# Altium project BIO26_pishield.PrjPcb
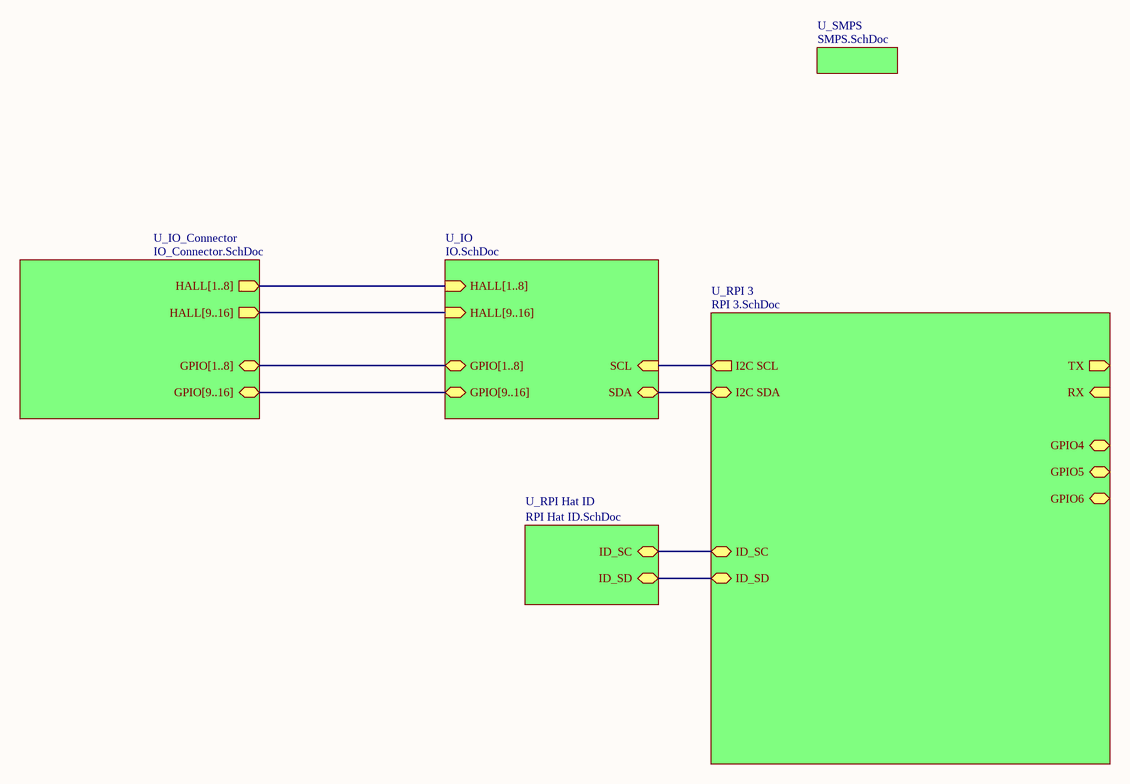
[diagram p0: BIO26_pishield.SchDoc]
6 sheets, 29 parts. Net scope: hierarchical (ports join the sheet entries above them; power ports are global).
Board file: BIO26_pishield.PcbDoc
Sheets:
  BIO26_pishield.SchDoc
    U_RPI 3 = RPI 3.SchDoc
    U_RPI Hat ID = RPI Hat ID.SchDoc
    U_SMPS = SMPS.SchDoc
    U_IO_Connector = IO_Connector.SchDoc
    U_IO = IO.SchDoc

## Sheet BIO26_pishield.SchDoc
size A4

### Sub-sheets
U_IO = IO.SchDoc: SCL (in), SDA (bidir), HALL[1..8] (in), HALL[9..16] (in), GPIO[1..8] (bidir), GPIO[9..16] (bidir)
U_IO_Connector = IO_Connector.SchDoc: HALL[1..8] (out), HALL[9..16] (out), GPIO[1..8] (bidir), GPIO[9..16] (bidir)
U_RPI 3 = RPI 3.SchDoc: GPIO4 (bidir), GPIO6 (bidir), GPIO5 (bidir), RX (in), TX (out), ID_SC (bidir), ID_SD (bidir), I2C SDA (bidir), I2C SCL (out)
U_RPI Hat ID = RPI Hat ID.SchDoc: ID_SC (bidir), ID_SD (bidir)
U_SMPS = SMPS.SchDoc: no entries

### Nets
I2C SCL: sheet U_RPI 3/I2C SCL, sheet U_IO/SCL
I2C SDA: sheet U_RPI 3/I2C SDA, sheet U_IO/SDA
NetR1_1: sheet U_RPI 3/ID_SD, sheet U_RPI Hat ID/ID_SD
NetR2_1: sheet U_RPI 3/ID_SC, sheet U_RPI Hat ID/ID_SC

### Buses and harness runs
bus sheet U_IO/GPIO[1..8] = sheet U_IO_Connector/GPIO[1..8]
bus sheet U_IO/GPIO[9..16] = sheet U_IO_Connector/GPIO[9..16]
bus sheet U_IO/HALL[1..8] = sheet U_IO_Connector/HALL[1..8]
bus sheet U_IO/HALL[9..16] = sheet U_IO_Connector/HALL[9..16]

## Sheet RPI 3.SchDoc
size A4; SheetNumber: 1; SheetTotal: 1
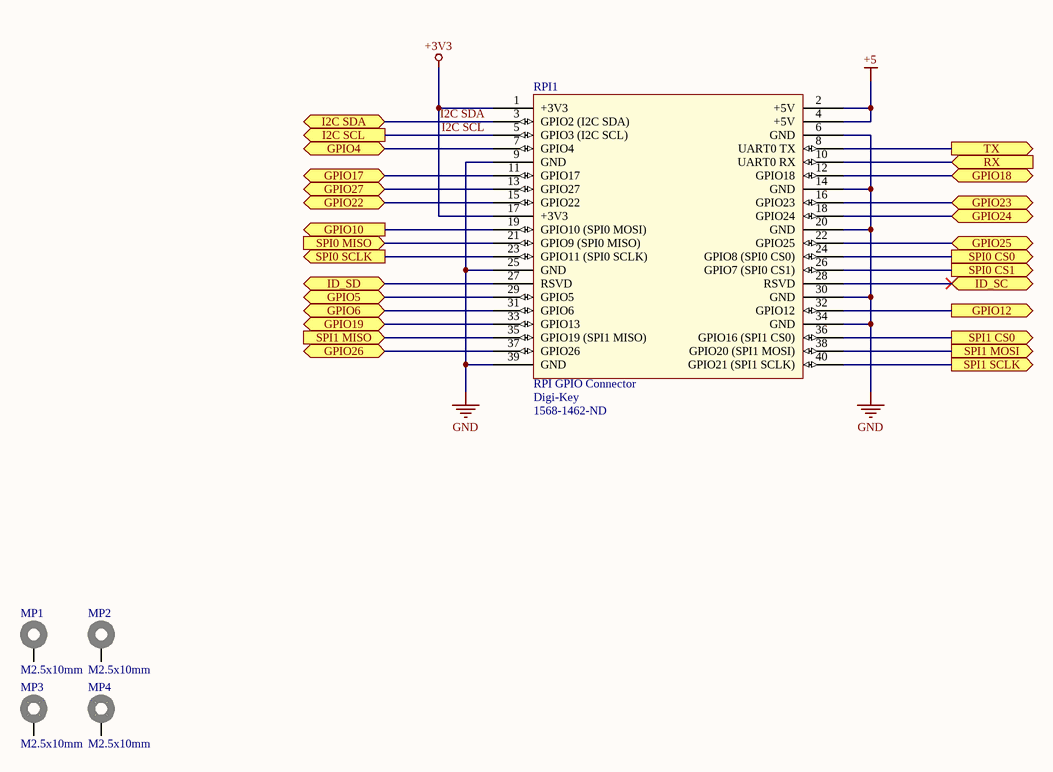
[diagram p1: RPI 3.SchDoc]

### Parts
MP1  M2.5x10mm  [9774100151]
MP2  M2.5x10mm  [9774100151]
MP3  M2.5x10mm  [9774100151]
MP4  M2.5x10mm  [9774100151]
RPI1  RPI GPIO Connector  Supplier 1: Digi-Key  Supplier Part Number 1: 1568-1462-ND  [rpi]

### Ports
GPIO4 (bidir), GPIO5 (bidir), GPIO6 (bidir), GPIO10 (out), GPIO12 (out), GPIO17 (bidir), GPIO18 (bidir), GPIO19 (bidir), GPIO22 (bidir), GPIO23 (bidir), GPIO24 (bidir), GPIO25 (bidir), GPIO26 (bidir), GPIO27 (bidir), I2C SCL (out), I2C SDA (bidir), ID_SC (bidir), ID_SD (bidir), RX (in), SPI0 CS0 (out), SPI0 CS1 (out), SPI0 MISO (in), SPI0 SCLK (out), SPI1 CS0 (out), SPI1 MISO (in), SPI1 MOSI (out), SPI1 SCLK (out), TX (out)

### Nets
+3V3: RPI1.1(+3V3) RPI1.17(+3V3)
+5: RPI1.2(+5V) RPI1.4(+5V)
GND: RPI1.6(GND) RPI1.9(GND) RPI1.14(GND) RPI1.20(GND) RPI1.25(GND) RPI1.30(GND) RPI1.34(GND) RPI1.39(GND)
I2C SCL: RPI1.5(GPIO3_(I2C_SCL)) ; port I2C SCL
I2C SDA: RPI1.3(GPIO2_(I2C_SDA)) ; port I2C SDA
NetR1_1: RPI1.27(RSVD) ; port ID_SD
NetR2_1: RPI1.28(RSVD) ; port ID_SC
NetRPI1_7: RPI1.7(GPIO4) ; port GPIO4
NetRPI1_8: RPI1.8(UART0_TX) ; port TX
NetRPI1_10: RPI1.10(UART0_RX) ; port RX
NetRPI1_11: RPI1.11(GPIO17) ; port GPIO17
NetRPI1_12: RPI1.12(GPIO18) ; port GPIO18
NetRPI1_13: RPI1.13(GPIO27) ; port GPIO27
NetRPI1_15: RPI1.15(GPIO22) ; port GPIO22
NetRPI1_16: RPI1.16(GPIO23) ; port GPIO23
NetRPI1_18: RPI1.18(GPIO24) ; port GPIO24
NetRPI1_19: RPI1.19(GPIO10_(SPI0_MOSI)) ; port GPIO10
NetRPI1_21: RPI1.21(GPIO9_(SPI0_MISO)) ; port SPI0 MISO
NetRPI1_22: RPI1.22(GPIO25) ; port GPIO25
NetRPI1_23: RPI1.23(GPIO11_(SPI0_SCLK)) ; port SPI0 SCLK
NetRPI1_24: RPI1.24(GPIO8_(SPI0_CS0)) ; port SPI0 CS0
NetRPI1_26: RPI1.26(GPIO7_(SPI0_CS1)) ; port SPI0 CS1
NetRPI1_29: RPI1.29(GPIO5) ; port GPIO5
NetRPI1_31: RPI1.31(GPIO6) ; port GPIO6
NetRPI1_32: RPI1.32(GPIO12) ; port GPIO12
NetRPI1_33: RPI1.33(GPIO13) ; port GPIO19
NetRPI1_35: RPI1.35(GPIO19_(SPI1_MISO)) ; port SPI1 MISO
NetRPI1_36: RPI1.36(GPIO16_(SPI1_CS0)) ; port SPI1 CS0
NetRPI1_37: RPI1.37(GPIO26) ; port GPIO26
NetRPI1_38: RPI1.38(GPIO20_(SPI1_MOSI)) ; port SPI1 MOSI
NetRPI1_40: RPI1.40(GPIO21_(SPI1_SCLK)) ; port SPI1 SCLK

Not connected (* = marked no-connect by the designer): MP1 1; MP2 1; MP3 1; MP4 1

### Library data of the parts
MP1-MP4 = 9774100151: WA-SMSI SMT Steel Spacer, OD5.1mm, M2.5x10mm; Inner Diameter: 3.5mm; Outer Diameter: 5.1mm; Surface: Tin; Thread: M2.5; ComponentLink1Description: Manufacturer; ComponentLink1URL: http://www.we-online.de; ComponentLink2Description: Datasheet; ComponentLink2URL: https://katalog.we-online.com/em/datasheet/9774100151.pdf; Mounting Technology: SMT; Packaging: Bulk; Part Number: 9774100151; Length: 10mm; Inner Thread Length: -; Operating Temperature: -55 to +150degC; Publisher: Wurth Elektronik; Published Date: September 2019; Material: Steel
RPI1 = rpi connector: GPIO Header for Raspberry Pi A+/B+/Pi 2/Pi 3 - 2x20; Manufacturer: SparkFun Electronics; Manufacturer Part Number: PRT-14017; Nils Minor: author; nilsminor@web.de: mail; RoHS: RoHS Compliant; Category: Development Boards, Kits, Programmers; Stock 1: 150; Pricing 1: 1=1.84 (EUR); Part Status: Active; Accessory Type: Connector; For Use With/Related Products: Raspberry Pi; ComponentLink1URL: https://cdn.sparkfun.com/datasheets/Dev/RaspberryPi/12313.pdf; ComponentLink1Description: https://cdn.sparkfun.com/datasheets/Dev/RaspberryPi/12313.pdf

## Sheet RPI Hat ID.SchDoc
size A4
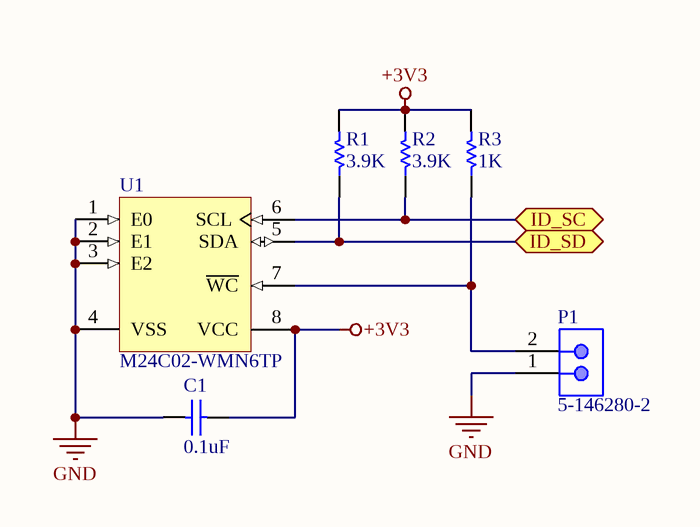
[diagram p2: RPI Hat ID.SchDoc]

### Parts
C1  0.1uF  [CAPC1608X87X35NL15T15]
P1  5-146280-2  [TECO-5-146280-2_V]
R1  3.9K  [RESC1608X55X30ML15T15]
R2  3.9K  [RESC1608X55X30ML15T15]
R3  1K  [RESC1608X55X30ML15T15]
U1  M24C02-WMN6TP  [STM-M24C02-WMN6TP-8_M]

### Ports
ID_SC (bidir), ID_SD (bidir)

### Nets
+3V3: C1.1 R1.2 R2.2 R3.2 U1.8(VCC)
GND: C1.2 P1.1 U1.1(E0) U1.2(E1) U1.3(E2) U1.4(VSS)
NetP1_2: P1.2 R3.1 U1.7(~{WC})
NetR1_1: R1.1 U1.5(SDA) ; port ID_SD
NetR2_1: R2.1 U1.6(SCL) ; port ID_SC

### Library data of the parts
C1 = CMP-2006-03300-1: Part Number: C0603X104K5RACTU; Manufacturer: Kemet
P1 = CMP-2000-07492-1: Male Header, Pitch 2.54 mm, 1 x 2 Position, Height 8.21 mm, Tail Length 3.05 mm, -65 to 105 degC, RoHS, Bulk; Manufacturer: TE Connectivity; Mating Connector Lock: No(Without); Number of Positions: 2; Pitch: 2.54mm; PCB Mounting Orientation: Vertical; Keyed: No; Case\/Package: 100; Mating Post Length: 0.23inch; High Temperature Housing: Yes; Max Current Rating: 5A; PCB Thickness: 0.063inch; PCB Mount Retention: Without; Approvals: CSA; Current Rating: 3A; Radiation Hardening: No; Length: 4.67mm; Contact Mating Length: 0.23inch; Connector Type: Header; Number of Rows: 1; Termination Post Length: 0.12inch; Board Standoff: No(Without); Max Operating Temperature: 105degC; Contact Shape: Square; Selectively Loaded: No(Without); Gasket: No(Without); Number of Contacts: 2; Contact Gender: Male; Mating Alignment: No(Without); Manufacturer URL: http://www.te.com/; Datasheet URL: http://www.te.com/commerce/DocumentDelivery/DDEController?Action=showdoc&DocId=Customer+Drawing%7F146280%7FH1%7Fpdf%7FEnglish%7FENG_CD_146280_H1.pdf%7F5-146280-2; Mount: ThroughHole; Orientation: Straight; Packaging: Carton; Package Reference: 5-146280-2; Package Quantity: 500; Stabilizers: No(Without); Row Spacing: 2.54mm; Contact Material: CopperAlloy; Panel Mount Retention: No(Without); Datasheet Version: Rev. H1, 08/2016; Housing Colour: Black; Colour: Black; Package Description: Male Header, Pitch 2.54 mm, 1 x 2 Position, Height 8.21 mm, Tail Length 3.05 mm; Contact Plating: Matte; Housing Material: Polymer; Contact Protection: No(Without); Min Operating Temperature: -65degC; Mounting Technology: ThroughHole; Flammability Rating: UL94V-0; RoHSCompliant: true; Termination: ThroughHole; Depth: 2.34mm; High Speed Serial Data Connector: No
R1-R3 = CMP-2000-00180-1: Part Number: ERJ-3EKF1001V; Manufacturer: Panasonic
U1 = CMP-2000-05370-1: EEPROM Serial-I2C, 2Kbit, 2.5 to 5.5 V, 400 kHz, 8-Pin SO, -40 to 85 degC, RoHS, Tape and Reel; Manufacturer: STMicroelectronics; Supply Current: 2mA; Frequency: 0.4MHz; Data Retention: 40; Density: 2048Bit; Rad Hardened: No; Write Protection: Yes; Interface Type: Serial(I2C); DELETED: Compliant; Access Time (Max): 900ns; Operating Supply Voltage (Typ): 3.3/5V; Operating Supply Voltage (Max): 5.5V; Organization: 256x8; Operating Supply Voltage (Min): 2.5V; Operating Temperature (Max): 85C; Operating Temperature Classification: Industrial; Operating Temp Range: -40Cto85C; Frequency (Max): 0.4MHz; Datasheet URL: https://datasheet.ciiva.com/26870/m24c02-wmn6tp-26870257.pdf; Package Type: SOICN; Operating Temperature (Min): -40C; Programmable: Yes; Manufacturer URL: http://www.st.com/; Pin Count: 8; Packaging: TapeandReel; Mounting: SurfaceMount; Datasheet Version: Rev. 17, 04/2011

## Sheet SMPS.SchDoc
size A4
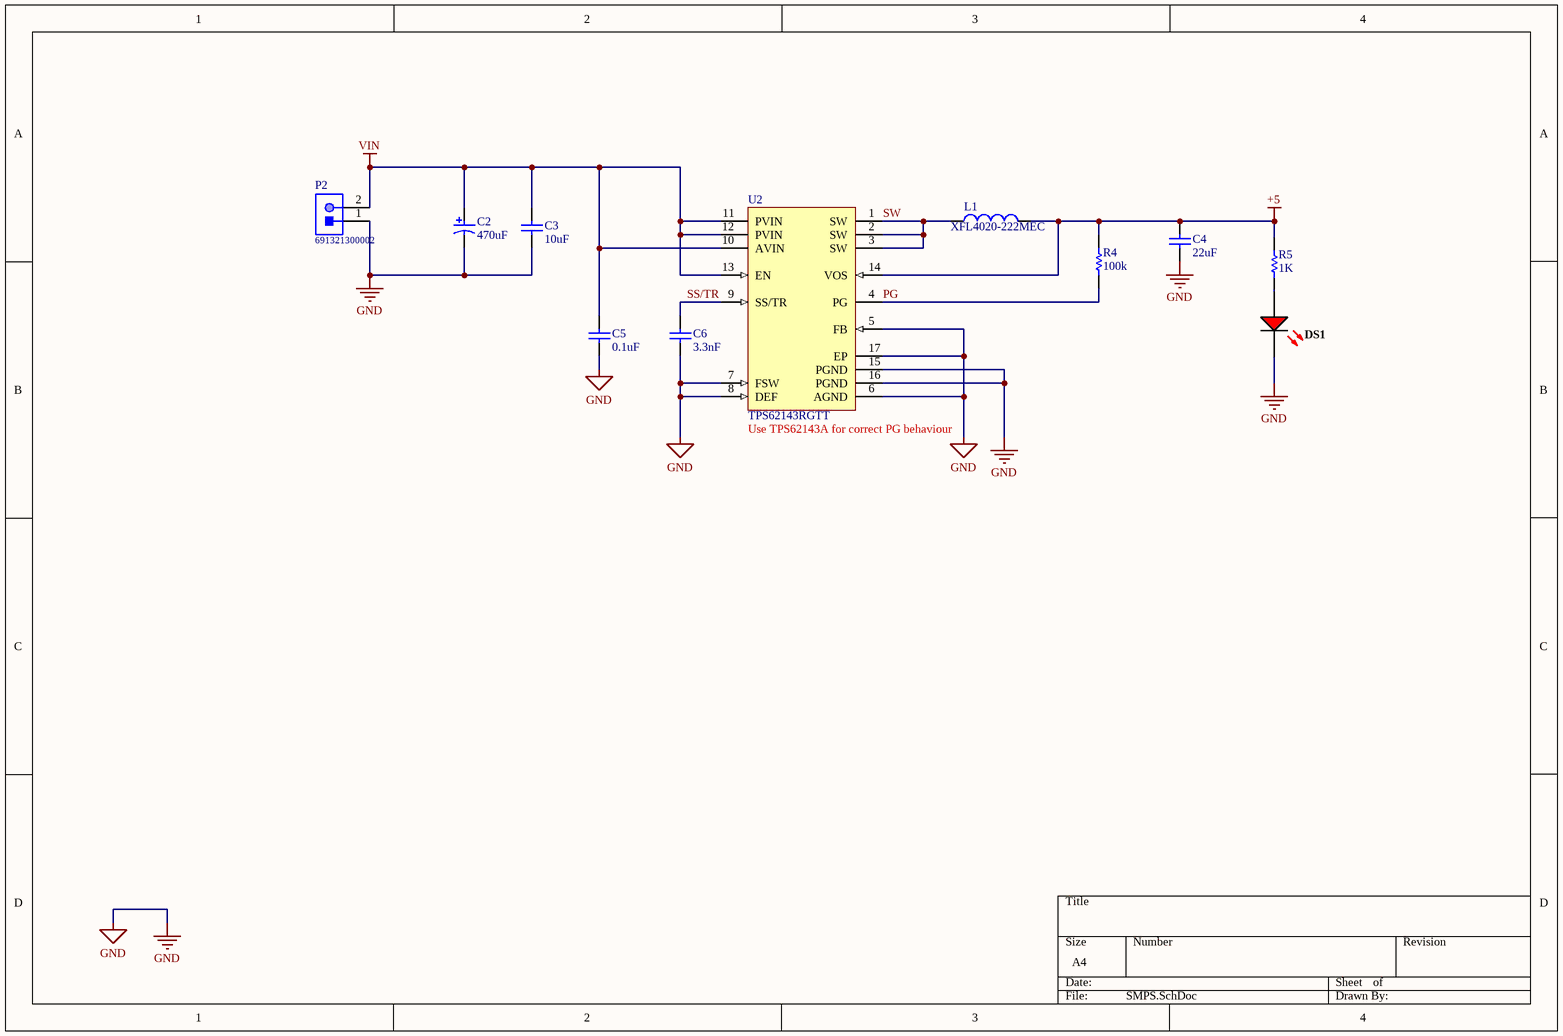
[diagram p3: SMPS.SchDoc]

### Parts
C2  470uF  [PNSC-FK-V-F_V]
C3  10uF  [CAPC1210(3225)210_M]
C4  22uF  [CAPC2013X95X45ML15T25]
C5  0.1uF  [CAPC1608X87X35NL15T15]
C6  3.3nF  [CAPC1608X87X35NL15T15]
DS1  APG1608SURKC/T  [KING-LED0603-25-RED_V]  (value not drawn)
L1  XFL4020-222MEC  [COIL-IND-2_V]
P2  691321300002  [691321300002]
R4  100k  [RESC1608X55X25ML10T15]
R5  1K  [RESC1608X55X30LL15T15]
U2  TPS62143RGTT  [RGT0016C_V]

### Nets
+5: C4.2 L1.2 R4.2 R5.2 U2.14(VOS)
GND: C2.2 C3.1 C4.1 C5.2 C6.1 DS1.2(K) P2.1 U2.5(FB) U2.6(AGND) U2.7(FSW) U2.8(DEF) U2.15(PGND) U2.16(PGND) U2.17(EP)
VIN: C2.1 C3.2 C5.1 P2.2 U2.10(AVIN) U2.11(PVIN) U2.12(PVIN) U2.13(EN)
PG: R4.1 U2.4(PG)
SS/TR: C6.2 U2.9(SS/TR)
SW: L1.1 U2.1(SW) U2.2(SW) U2.3(SW)
NetDS1_1: DS1.1(A) R5.1

### Notes on the sheet
- (near U2) Use TPS62143A for correct PG behaviour

### Library data of the parts
C2 = CMP-2000-06204-1: Aluminum Electrolytic Capacitor, 470 uF, +/- 20%, 16 V, 2-Pin SMD (Size Code F), -55 to 105 degC, RoHS, Tape and Reel; Manufacturer: Panasonic; Capacitance: 470µF; Type: Can; Ripple Current: 600mA; Lifetime@Temperature: 2000Hrs@105°C; Impedance: 0.16O; Rated Voltage: 16V; Manufacturer URL: http://www.panasonic.com/; Package Description: 2-Pin Electrolytic Aluminum Capacitor, Body 8.3 x 8.3 mm; Operating Temp-Max: 105°C; Mounting Technology: SurfaceMount; Operating Temp Range: -55to+105°C; Datasheet Version: 03/2016; Series: FK; Package Reference: FK-V-F; Case Size/Dimension: Ø8x10.2mm; Package URL: http://industrial.panasonic.com/cdbs/www-data/pdf/RDE0000/DME0000COL48.pdf; Datasheet URL: http://industrial.panasonic.com/cdbs/www-data/pdf/RDE0000/ABA0000C1181.pdf
C3 = CMP-1038-02235-1: CAP 10uF 35V ±20% 1210 (3225 Metric) Thickness 2.1mm SMD; Tolerance: Â±20%; Case-Metric: 3225; Case-EIA: 1210; Technology: SMT; Rated Voltage: 35 V; Value: 10uF; Max Thickness: 2.1 mm
C4 = CMP-2007-00096-1: Manufacturer: Murata; Part Number: GRM219R61A226MEA0D
C5 = CMP-2006-03300-1: as C1 on sheet RPI Hat ID
C6 = CMP-2006-03881-1: Part Number: C0603C332K5RAC7867; Manufacturer: Kemet
DS1 = CMP-0404-00004-1: Ultra Thin Hyper Red SMD Chip LED Lamp, 2 to 2.5 V, -40 to 85 degC, Body 1.6 x 0.8 mm, 0.28 mm Thickness, RoHS, Tape and Reel; Manufacturer: Kingbright; Dice: Hyper Red (AlGaInP); IR (Max): 10 uA; Luminous Intensity mcd @ 20 mA (Min.): 55; Lens Type: Water Clear; Viewing Angle: 120; Luminous Intensity mcd @ 20 mA (Typ.): 110; ComponentLink2Description: Datasheet; ComponentLink3URL: http://www.kingbrightusa.com/images/catalog/SPEC/APG1608SURKC-T.pdf; Packing: Tape and Reel; Mounting Technology: Surface Mount; PackageVersion: Rev. V.5A; ComponentLink1Description: Manufacturer URL; ComponentLink2URL: http://www.kingbrightusa.com/images/catalog/SPEC/APG1608SURKC-T.pdf; ComponentLink3Description: Package Specification; PackageDescription: 2-Pin SMT, Body 1.6 x 0.8 mm, 0.28mm Thickness, Red; PackageReference: LED0603-25-RED; DatasheetVersion: Rev. V.5A; Operating Temperature: -40 to 85 degC; PartNumber: APG1608SURKC/T; ComponentLink1URL: http://www.kingbrightusa.com/; Forward Voltage: 2 to 2.5 V; RoHS: TRUE
L1 = CMP-2000-05090-2: High Temperature Shielded Power Inductor, 2.2 uH, +/- 20 %, -40 to 125 degC, 2-Pin SMD, RoHS, Tape and Reel; Manufacturer: Coilcraft; Case Length: 4.3mm; Case Height: 2.1mm; Tolerance: 20%; Self Resonant Frequency: 38MHz; Inductance: 2.2uH; Maximum DC Resistance: 23.5mOhms; Test Frequency: 100kHz; Core Material: Composite; Maximum DC Current: 8A; Case Width: 4.3mm; Series: XFL4020; RoHS: Details; Termination Style: SMD/SMT; PartNumber: XFL4020-222MEC; Datasheet Version: Jul-12; Shielding: Shielded; Datasheet URL: http://www.mouser.com/ds/2/597/xfl4020-270756.pdf; Dimensions: 4.3mmWx4.3mmLx2.1mmH; Operating Temperature Range: -40Cto+125C; Packaging: Reel; Product: PowerInductors; Manufacturer URL: http://www.coilcraft.com/
P2 = CMP-1502-01863-1: Serie 321 - 3.81mm Vertical PCB Header WR-TBL, 2 pin; Manufacturer: Wurth Elektronik; Pin Number: 2; Gender: Male; Part Number: 691321300002; Manufacturer URL: http://www.we-online.de; Mounting Technology: THT; Datasheet URL: http://katalog.we-online.de/em/datasheet/6913213000xx.pdf; Package Reference: 691321300002; Packaging: Box; Pitch: 3.81mm; Operating Temperature: -40to105degC; Publisher: WurthElektronik
R4 = CMP-2100-03662-1: Chip Resistor, 100 KOhm, +/- 1%, 0.1 W, -55 to 155 degC, 0603 (1608 Metric), RoHS, Tape and Reel; Manufacturer: Yageo; Power Rating: 100mW; Voltage Rating: 50V; Temperature Coefficient: 100ppm/degreesC; Datasheet Version: Rev. 5, 10/2016; Height: 0.45mm; Lead Free: LeadFree; Manufacturer URL: http://www.yageo.com/; Package Reference: 0603; Depth: 0.8mm; RoHSCompliant: true; Composition: ThickFilm; Military Standard: Not; Resistance: 100KOhm; Case/Package: 0603; Packaging: TapeandReel; Case Code (Imperial): 0603; Voltage Rating (DC): 50V; Case Code (Metric): 1608; Tolerance: 1%; Termination: SMD/SMT; Min Operating Temperature: -55degC; Number of Pins: 2; Length: 1.6mm; Width: 0.8mm; Datasheet URL: http://www.yageo.com/NewPortal/yageodocoutput?fileName=/pdf/R-Chip/PYu-RC_Group_51_RoHS_L_5.pdf; Package Description: 2-Pin Surface Mount Device, Body 1.6 x 0.8 mm; Max Operating Temperature: 155degC; REACH SVHC: NoSVHC
R5 = CMP-2000-00180-1: as R1 on sheet RPI Hat ID
U2 = CMP-0323-00125-3: Buck Step Down Regulator with 3 to 17 V Input and 5 V Output, -40 to 85 degC, 16-Pin QFN (RGT), Green (RoHS & no Sb/Br); Manufacturer: Texas Instruments; Vin(Max)(V): 17; Synchronous Rectification: TRUE; Vout(Min)(V): 5; Vin(Min)(V): 3; Duty Cycle(Max)(%): 100; Iout(Max)(A): 2; Regulated Outputs(#): 1; Iq(Typ)(mA): 0.017; Rating: Catalog; SubFamily: Step-Down Regulator; ComponentLink2Description: Package Specification; PackageVersion: revH, Oct-2011; ComponentLink1Description: Datasheet; ComponentLink3Description: URL Link1; Code_JEDEC: MO-220; Mounting Technology: Surface Mount; PartNumber: TPS62143RGTT; Vout(Max)(V): 5; Topology: Buck; ComponentLink1URL: http://www.ti.com/general/docs/lit/getliterature.tsp?genericPartNumber=TPS62143&fileType=pdf; Eco-Plan: Green (RoHS & no Sb/Br); Preset Vout(V): 5; PackageReference: RGT0016C; Switch Current Limit(Typ)(A): 3; ComponentLink2URL: http://www.ti.com/litv/pdf/mpqf119g; DatasheetVersion: SLVSAJ0; ComponentLink3URL: Samples URL:http://www.ti.com/product/tps54611#samples; PackageDescription: 16-Pin Plastic Quad Flat No-Lead, 3 x 3 mm Body, 0.5 mm Pitch, 1.7 x 1.7 mm Exposed Pad

## Sheet IO_Connector.SchDoc
size A4
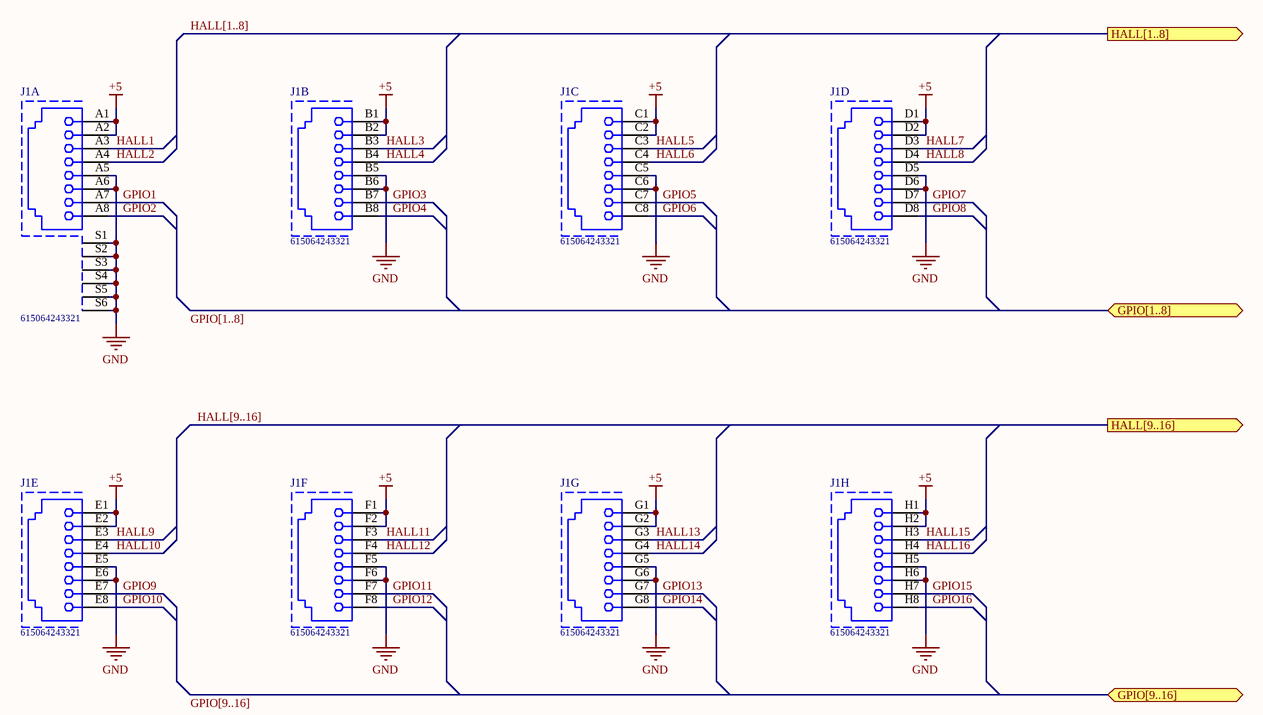
[diagram p4: IO_Connector.SchDoc]

### Parts
J1  615064243321  [615064243321]  (parts A,B,C,D,E,F,G,H of 8)

### Ports
GPIO[1..8] (bidir), GPIO[9..16] (bidir), HALL[1..8] (out), HALL[9..16] (out)

### Nets
+5: J1.A1 J1.A2 J1.B1 J1.B2 J1.C1 J1.C2 J1.D1 J1.D2 J1.E1 J1.E2 J1.F1 J1.F2 J1.G1 J1.G2 J1.H1 J1.H2
GND: J1.A5 J1.A6 J1.B5 J1.B6 J1.C5 J1.C6 J1.D5 J1.D6 J1.E5 J1.E6 J1.F5 J1.F6 J1.G5 J1.G6 J1.H5 J1.H6 J1.S1 J1.S2 J1.S3 J1.S4 J1.S5 J1.S6
GPIO1: J1.A7
GPIO2: J1.A8
GPIO3: J1.B7
GPIO4: J1.B8
GPIO5: J1.C7
GPIO6: J1.C8
GPIO7: J1.D7
GPIO8: J1.D8
GPIO9: J1.E7
GPIO10: J1.E8
GPIO11: J1.F7
GPIO12: J1.F8
GPIO13: J1.G7
GPIO14: J1.G8
GPIO15: J1.H7
GPIO16: J1.H8
HALL1: J1.A3
HALL2: J1.A4
HALL3: J1.B3
HALL4: J1.B4
HALL5: J1.C3
HALL6: J1.C4
HALL7: J1.D3
HALL8: J1.D4
HALL9: J1.E3
HALL10: J1.E4
HALL11: J1.F3
HALL12: J1.F4
HALL13: J1.G3
HALL14: J1.G4
HALL15: J1.H3
HALL16: J1.H4

### Buses and harness runs
bus GPIO[1..8] = port GPIO[1..8]
bus GPIO[9..16] = port GPIO[9..16]
bus HALL[1..8] = port HALL[1..8]
bus HALL[9..16] = port HALL[9..16]

### Library data of the parts
J1 = CMP-1502-01714-1: Modular Jack WR-MJ, Tab Up & Down, Shielded, 2 x 4 Stacked with EMI Panel Finger, Horizontal Entry, THT, 8P8C; Manufacturer: Wurth Elektronik; Working Voltage: 120VAC; Withstanding Voltage: 1000VAC; Port: 2x4; Compliance: Leadfree/RoHS; Contact Resistance: 20mOhm; Rated Current: 1.5A; Mounting Technology: THT; Part Number: 615064243321; Publisher: WurthElektronik; Package Reference: 615064243321; Packaging: Tray; Manufacturer URL: http://www.we-online.de; Operating Temperature: -40to85degC; Entrance: Horizontal; Datasheet URL: https://katalog.we-online.de/em/datasheet/615064243321.pdf; Pin Number: 8P8C

## Sheet IO.SchDoc
size A4
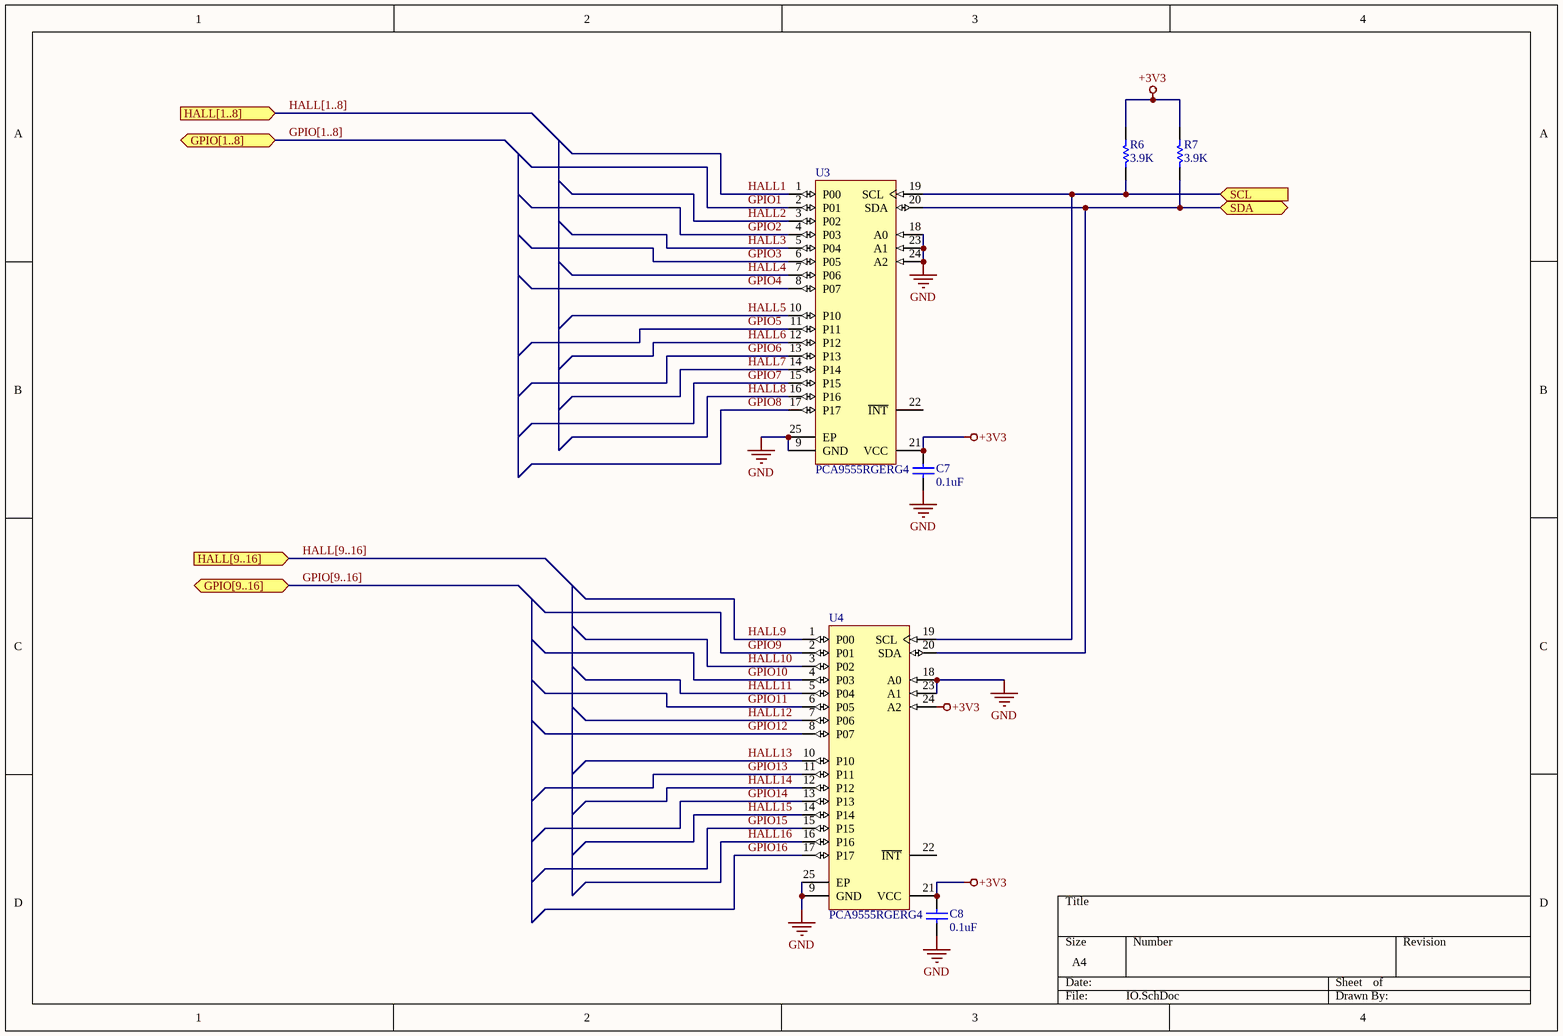
[diagram p5: IO.SchDoc]

### Parts
C7  0.1uF  [CAPC1608X87X35NL15T15]
C8  0.1uF  [CAPC1608X87X35NL15T15]
R6  3.9K  [RESC1608X55X30ML15T15]
R7  3.9K  [RESC1608X55X30ML15T15]
U3  PCA9555RGERG4  [RGE24-2100X2100TP]
U4  PCA9555RGERG4  [RGE24-2100X2100TP]

### Ports
GPIO[1..8] (bidir), GPIO[9..16] (bidir), HALL[1..8] (in), HALL[9..16] (in), SCL (in), SDA (bidir)

### Nets
+3V3: C7.1 C8.1 R6.2 R7.2 U3.21(VCC) U4.21(VCC) U4.24(A2)
GND: C7.2 C8.2 U3.9(GND) U3.18(A0) U3.23(A1) U3.24(A2) U3.25(EP) U4.9(GND) U4.18(A0) U4.23(A1) U4.25(EP)
GPIO1: U3.2(P01)
GPIO2: U3.4(P03)
GPIO3: U3.6(P05)
GPIO4: U3.8(P07)
GPIO5: U3.11(P11)
GPIO6: U3.13(P13)
GPIO7: U3.15(P15)
GPIO8: U3.17(P17)
GPIO9: U4.2(P01)
GPIO10: U4.4(P03)
GPIO11: U4.6(P05)
GPIO12: U4.8(P07)
GPIO13: U4.11(P11)
GPIO14: U4.13(P13)
GPIO15: U4.15(P15)
GPIO16: U4.17(P17)
HALL1: U3.1(P00)
HALL2: U3.3(P02)
HALL3: U3.5(P04)
HALL4: U3.7(P06)
HALL5: U3.10(P10)
HALL6: U3.12(P12)
HALL7: U3.14(P14)
HALL8: U3.16(P16)
HALL9: U4.1(P00)
HALL10: U4.3(P02)
HALL11: U4.5(P04)
HALL12: U4.7(P06)
HALL13: U4.10(P10)
HALL14: U4.12(P12)
HALL15: U4.14(P14)
HALL16: U4.16(P16)
I2C SCL: R6.1 U3.19(SCL) U4.19(SCL) ; port SCL
I2C SDA: R7.1 U3.20(SDA) U4.20(SDA) ; port SDA

Not connected (* = marked no-connect by the designer): U3 22(~{INT}); U4 22(~{INT})

### Buses and harness runs
bus GPIO[1..8] = port GPIO[1..8]
bus GPIO[9..16] = port GPIO[9..16]
bus HALL[1..8] = port HALL[1..8]
bus HALL[9..16] = port HALL[9..16]

### Library data of the parts
C7 C8 = CMP-2006-03300-1: as C1 on sheet RPI Hat ID
R6 R7 = CMP-2000-00180-1: as R1 on sheet RPI Hat ID
U3 U4 = CMP-0314-00040-1: Remote 16-Bit I2C and SMBus I/O Expander with Interrupt Output and Configuration Registers, 2.3 to 5.5 V, -40 to 85 degC, 24-pin VQFN (RGE), Green (RoHS & no Sb/Br); Manufacturer: Texas Instruments; No. of Outputs: 2; fSCLK(Max)(MHz): 400; 5V Tolerant I/O: Yes; VCC(Min)(V): 2.3; VCC(Max)(V): 5.5; # of I/Os: 16; SubFamily: I2C IO Expander; I2C Address: 0100 xxx; Eco-Plan: Green (RoHS & no Sb/Br); DatasheetVersion: SCPS131E; ComponentLink2Description: Package Specification; Mounting Technology: Surface Mount; PackageVersion: revG, Jul-2011; Push-Pull I/O Type: Yes; Configuration Registers: Yes; PackageReference: RGE24-2100X2100TP; Max Frequency(kHz): 400; ComponentLink1Description: Datasheet; ComponentLink2URL: http://www.ti.com/litv/pdf/mpds211a; Vcc range(V): 2.3 to 5.5; ComponentLink1URL: http://www.ti.com/general/docs/lit/getliterature.tsp?genericPartNumber=PCA9555&fileType=pdf; Interrupt Output: Yes; PackageDescription: 24-Pin Plastic Quad Flatpack No-Lead, 4 x 4 mm Body, 0.5 mm Pitch; Code_JEDEC: MO-220; PartNumber: PCA9555RGERG4

## Nets that join several sheets
+3V3: RPI 3 (RPI1.1 RPI1.17), RPI Hat ID (5 pins), IO (7 pins)
+5: RPI 3 (RPI1.2 RPI1.4), SMPS (5 pins), IO_Connector (16 pins)
GND: RPI 3 (8 pins), RPI Hat ID (6 pins), SMPS (14 pins), IO_Connector (22 pins), IO (11 pins)
GPIO1: IO_Connector (J1.A7), IO (U3.2)
GPIO2: IO_Connector (J1.A8), IO (U3.4)
GPIO3: IO_Connector (J1.B7), IO (U3.6)
GPIO4: IO_Connector (J1.B8), IO (U3.8)
GPIO5: IO_Connector (J1.C7), IO (U3.11)
GPIO6: IO_Connector (J1.C8), IO (U3.13)
GPIO7: IO_Connector (J1.D7), IO (U3.15)
GPIO8: IO_Connector (J1.D8), IO (U3.17)
GPIO9: IO_Connector (J1.E7), IO (U4.2)
GPIO10: IO_Connector (J1.E8), IO (U4.4)
GPIO11: IO_Connector (J1.F7), IO (U4.6)
GPIO12: IO_Connector (J1.F8), IO (U4.8)
GPIO13: IO_Connector (J1.G7), IO (U4.11)
GPIO14: IO_Connector (J1.G8), IO (U4.13)
GPIO15: IO_Connector (J1.H7), IO (U4.15)
GPIO16: IO_Connector (J1.H8), IO (U4.17)
HALL1: IO_Connector (J1.A3), IO (U3.1)
HALL2: IO_Connector (J1.A4), IO (U3.3)
HALL3: IO_Connector (J1.B3), IO (U3.5)
HALL4: IO_Connector (J1.B4), IO (U3.7)
HALL5: IO_Connector (J1.C3), IO (U3.10)
HALL6: IO_Connector (J1.C4), IO (U3.12)
HALL7: IO_Connector (J1.D3), IO (U3.14)
HALL8: IO_Connector (J1.D4), IO (U3.16)
HALL9: IO_Connector (J1.E3), IO (U4.1)
HALL10: IO_Connector (J1.E4), IO (U4.3)
HALL11: IO_Connector (J1.F3), IO (U4.5)
HALL12: IO_Connector (J1.F4), IO (U4.7)
HALL13: IO_Connector (J1.G3), IO (U4.10)
HALL14: IO_Connector (J1.G4), IO (U4.12)
HALL15: IO_Connector (J1.H3), IO (U4.14)
HALL16: IO_Connector (J1.H4), IO (U4.16)
I2C SCL: RPI 3 (RPI1.5), IO (R6.1 U3.19 U4.19)
I2C SDA: RPI 3 (RPI1.3), IO (R7.1 U3.20 U4.20)
NetR1_1: RPI 3 (RPI1.27), RPI Hat ID (R1.1 U1.5)
NetR2_1: RPI 3 (RPI1.28), RPI Hat ID (R2.1 U1.6)